# Altium schematic sheet Flash_RAM.SchDoc: TE0890 - S7Mini
size A4; Organization: Trenz Electronic GmbH; DocumentNumber: TE0890; Revision: 01; SheetNumber: 5; SheetTotal: 6; Date: 2018-08-06; Author: Vitali Tsiukala; CompanyName: Trenz Electronic GmbH; DrawnBy: Vitali Tsiukala; Engineer: Vitali Tsiukala; ProjectName: TE0723 Arduino
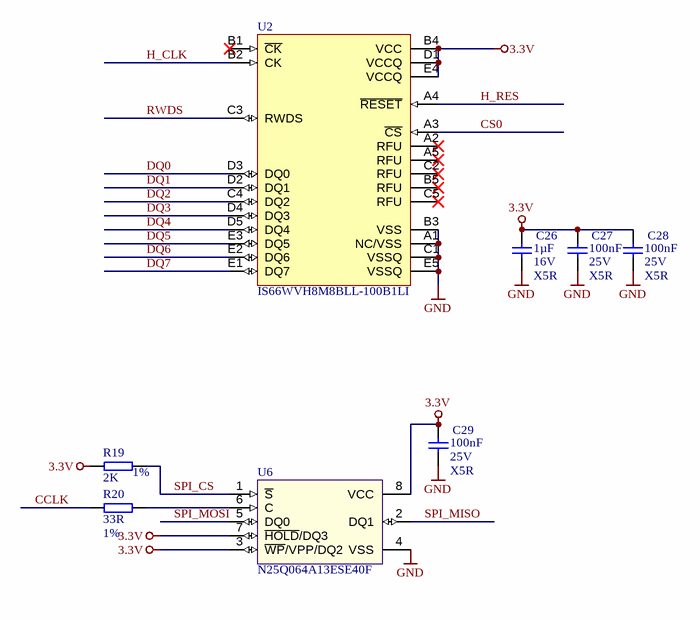
[diagram p0: Flash_RAM.SchDoc]

## Parts
C26  1µF  Voltage: 16V  Technology: X5R  [CAPC1005X55N]
C27  100nF  Voltage: 25V  Technology: X5R  [CAPC1005X55N]
C28  100nF  Voltage: 25V  Technology: X5R  [CAPC1005X55N]
C29  100nF  Voltage: 25V  Technology: X5R  [CAPC1005X55N]
R19  2K  Tolerance: 1%  [RESC1005X40N]
R20  33R  Tolerance: 1%  [RESC1005X40N]
U2  IS66WVH8M8BLL-100B1LI  [BGA25C100P5X5_800X600X120N]
U6  N25Q064A13ESE40F  [SOIC127P790X191-8N]

## Nets
3.3V: C26.1 C27.1 C28.1 C29.1 R19.1 U2.B4(VCC) U2.D1(VCCQ) U2.E4(VCCQ) U6.3(~{WP}/VPP/DQ2) U6.7(~{HOLD}/DQ3) U6.8(VCC)
GND: C26.2 C27.2 C28.2 C29.2 U2.A1(NC/VSS) U2.B3(VSS) U2.C1(VSSQ) U2.E5(VSSQ) U6.4(VSS)
CCLK: R20.1
CS0: U2.A3(~{CS})
DQ0: U2.D3(DQ0)
DQ1: U2.D2(DQ1)
DQ2: U2.C4(DQ2)
DQ3: U2.D4(DQ3)
DQ4: U2.D5(DQ4)
DQ5: U2.E3(DQ5)
DQ6: U2.E2(DQ6)
DQ7: U2.E1(DQ7)
H_CLK: U2.B2(CK)
H_RES: U2.A4(~{RESET})
RWDS: U2.C3(RWDS)
SPI_CS: R19.2 U6.1(~{S})
SPI_MISO: U6.2(DQ1)
SPI_MOSI: U6.5(DQ0)
NetR20_2: R20.2 U6.6(C)

Not connected (* = marked no-connect by the designer): U2 A2(RFU)* A5(RFU)* B1(~{CK})* B5(RFU)* C2(RFU)* C5(RFU)*

## Notes on the sheet
- Title:
- Number:
- Rev.
- Date:
- A4
- Copyright:
- Page
- of
- Filename:

## Library data of the parts
C26 = 26579: KON 1µF 16V X5R 10% SMD BF 1005 (0402); AN: 26579; Mixed: SMT; Value: 1u; Temperature-Range: -55/+85; Case: 1005 (0402); Tolerance: 10%
C27-C29 = 22472: KON 100nF 25V X5R ±10% SMD BF 1005 (0402); AN: 22472; Mixed: SMT; Value: 100n; Preferred: Yes; Temperature-Range: -55/+85; Case: 1005 (0402)
R19 = 25073: WID SMD 2K 1% 0,063W; AN: 25073; Mixed: SMT; H-ART: RC0402FR-072KL; Case: 1005 (0402); Technology: TK100; Value: 2K
R20 = 22770: WID SMD 33R 1% 0,063W BF 1005 (0402); AN: 22770; Mixed: SMT; Value: 33; Preferred: Yes; H-ART: RC0402FR-0733RL; Case: 1005 (0402); Technology: TK100
U2 = 29136: AN: 29136; Mixed: SMT; Temperature-Range: -40/+85; Case: BGA25; HelpURL: b:\AD\adlib\datasheet\IS6xWVH8M8\; H-ART: IS66WVH8M8BLL-100B1LI
U6 = 25582: N25Q064A13ESE40 64MBit Serial Flash; AN: 25582; Mixed: SMT; Case: SO8W 208-mil (SS); HelpURL: B:\AD\adlib\datasheet\N25Q064A; H-ART: N25Q064A13ESE40F